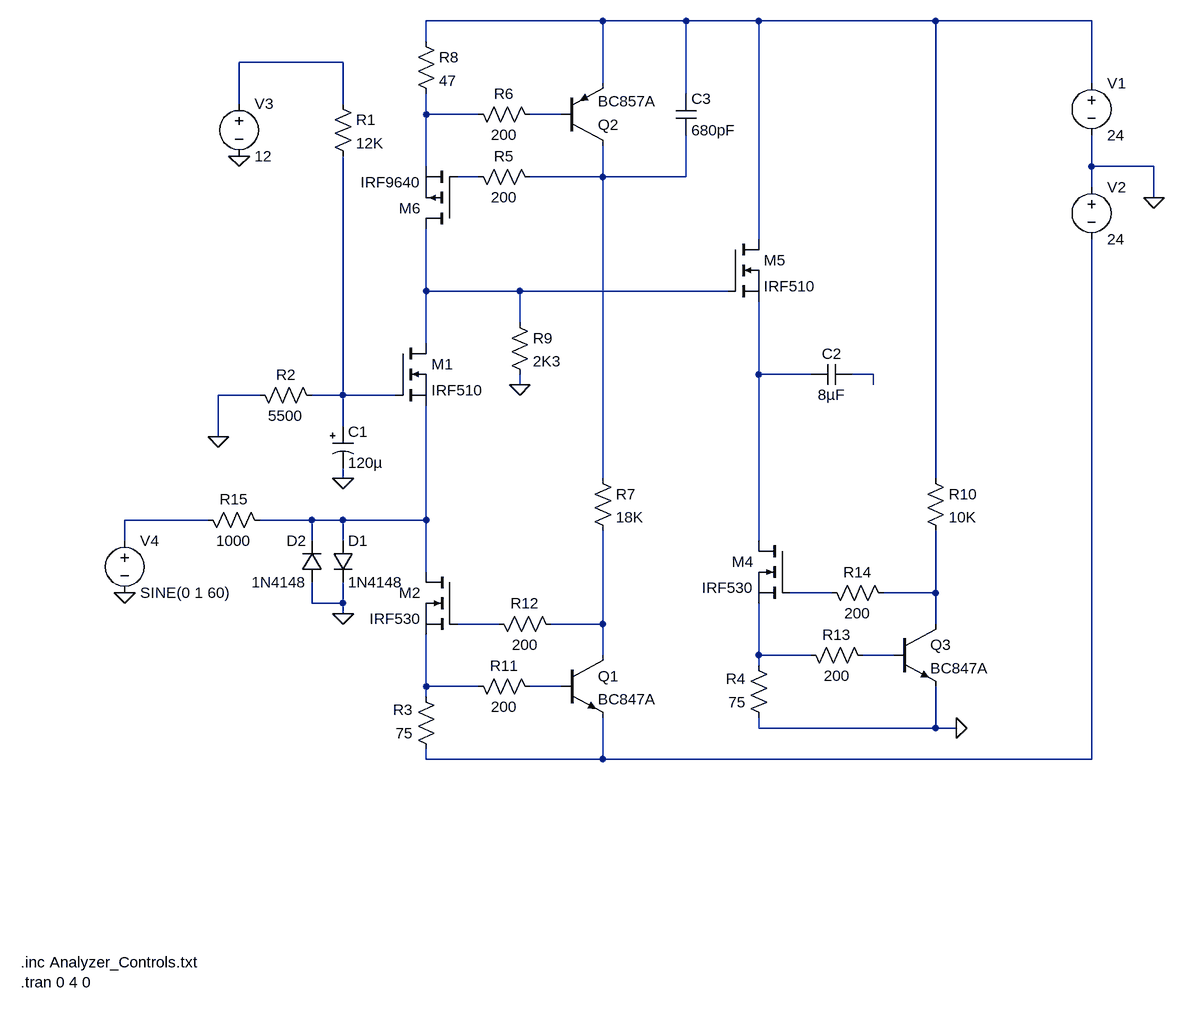
[diagram p0: schematic PASSD1.asc]
PASSD1.asc, the LTspice schematic file:
Version 4
SHEET 1 1876 1060
WIRE 288 -656 16 -656
WIRE 416 -656 288 -656
WIRE 528 -656 416 -656
WIRE 800 -656 528 -656
WIRE 1040 -656 800 -656
WIRE 16 -624 16 -656
WIRE -112 -592 -272 -592
WIRE 288 -560 288 -656
WIRE 1040 -560 1040 -656
WIRE 416 -544 416 -656
WIRE -272 -528 -272 -592
WIRE -112 -528 -112 -592
WIRE 16 -512 16 -544
WIRE 96 -512 16 -512
WIRE 224 -512 176 -512
WIRE 16 -432 16 -512
WIRE 1040 -432 1040 -480
WIRE 1136 -432 1040 -432
WIRE 96 -416 64 -416
WIRE 288 -416 288 -464
WIRE 288 -416 176 -416
WIRE 416 -416 416 -480
WIRE 416 -416 288 -416
WIRE 1040 -400 1040 -432
WIRE 1136 -384 1136 -432
WIRE 528 -320 528 -656
WIRE 16 -240 16 -336
WIRE 160 -240 16 -240
WIRE 480 -240 160 -240
WIRE 160 -192 160 -240
WIRE 16 -160 16 -240
WIRE 528 -112 528 -224
WIRE 608 -112 528 -112
WIRE 704 -112 672 -112
WIRE 160 -96 160 -112
WIRE 704 -96 704 -112
WIRE -240 -80 -304 -80
WIRE -112 -80 -112 -448
WIRE -112 -80 -160 -80
WIRE -32 -80 -112 -80
WIRE -112 -32 -112 -80
WIRE -304 -16 -304 -80
WIRE -112 48 -112 32
WIRE 288 48 288 -416
WIRE 800 48 800 -656
WIRE -320 112 -448 112
WIRE -160 112 -240 112
WIRE -112 112 -160 112
WIRE 16 112 16 -64
WIRE 16 112 -112 112
WIRE -448 144 -448 112
WIRE -160 144 -160 112
WIRE -112 144 -112 112
WIRE 528 144 528 -112
WIRE 16 192 16 112
WIRE 640 224 576 224
WIRE 800 224 800 128
WIRE 800 224 720 224
WIRE -160 240 -160 208
WIRE -112 240 -112 208
WIRE -112 240 -160 240
WIRE -112 256 -112 240
WIRE 128 272 64 272
WIRE 288 272 288 128
WIRE 288 272 208 272
WIRE 800 272 800 224
WIRE 288 320 288 272
WIRE 528 320 528 240
WIRE 608 320 528 320
WIRE 736 320 688 320
WIRE 528 336 528 320
WIRE 16 368 16 288
WIRE 96 368 16 368
WIRE 224 368 176 368
WIRE 16 384 16 368
WIRE 528 432 528 416
WIRE 800 432 800 368
WIRE 800 432 528 432
WIRE 832 432 800 432
WIRE 16 480 16 464
WIRE 288 480 288 416
WIRE 288 480 16 480
WIRE 1040 480 1040 -320
WIRE 1040 480 288 480
FLAG 160 -96 0
FLAG 1136 -384 0
FLAG -112 256 0
FLAG 832 432 0
FLAG -304 -16 0
FLAG -112 48 0
FLAG -272 -448 0
FLAG -448 224 0
SYMBOL res 32 480 R180
WINDOW 0 36 76 Left 2
WINDOW 3 36 40 Left 2
SYMATTR InstName R3
SYMATTR Value 75
SYMBOL npn 224 320 R0
SYMATTR InstName Q1
SYMATTR Value BC847A
SYMBOL pnp 224 -464 M180
SYMATTR InstName Q2
SYMATTR Value BC857A
SYMBOL res 272 32 R0
SYMATTR InstName R7
SYMATTR Value 18K
SYMBOL res 0 -640 R0
SYMATTR InstName R8
SYMATTR Value 47
SYMBOL res 144 -208 R0
SYMATTR InstName R9
SYMATTR Value 2K3
SYMBOL voltage 1040 -576 R0
WINDOW 123 0 0 Left 2
WINDOW 39 0 0 Left 2
SYMATTR InstName V1
SYMATTR Value 24
SYMBOL voltage 1040 -416 R0
WINDOW 123 0 0 Left 2
WINDOW 39 0 0 Left 2
SYMATTR InstName V2
SYMATTR Value 24
SYMBOL cap 672 -128 R90
WINDOW 0 0 32 VBottom 2
WINDOW 3 32 32 VTop 2
SYMATTR InstName C2
SYMATTR Value 8µF
SYMATTR SpiceLine V=600 Irms=0
SYMBOL cap 400 -544 R0
SYMATTR InstName C3
SYMATTR Value 680pF
SYMBOL diode -128 144 R0
SYMATTR InstName D1
SYMATTR Value 1N4148
SYMBOL diode -144 208 R180
WINDOW 0 24 64 Left 2
WINDOW 3 24 0 Left 2
SYMATTR InstName D2
SYMATTR Value 1N4148
SYMBOL res 544 432 R180
WINDOW 0 36 76 Left 2
WINDOW 3 36 40 Left 2
SYMATTR InstName R4
SYMATTR Value 75
SYMBOL npn 736 272 R0
SYMATTR InstName Q3
SYMATTR Value BC847A
SYMBOL res 784 32 R0
SYMATTR InstName R10
SYMATTR Value 10K
SYMBOL res -128 -544 R0
SYMATTR InstName R1
SYMATTR Value 12K
SYMBOL res -256 -96 M90
WINDOW 0 0 56 VBottom 2
WINDOW 3 32 56 VTop 2
SYMATTR InstName R2
SYMATTR Value 5500
SYMBOL polcap -128 -32 R0
WINDOW 3 24 56 Left 2
SYMATTR Value 120µ
SYMATTR InstName C1
SYMATTR Description Capacitor
SYMATTR Type cap
SYMATTR SpiceLine V=25 Irms=413m Rser=1 Lser=0
SYMBOL nmos -32 -160 R0
SYMATTR InstName M1
SYMATTR Value IRF510
SYMBOL nmos 64 192 M0
SYMATTR InstName M2
SYMATTR Value IRF530
SYMBOL res 80 -528 M90
WINDOW 0 0 56 VBottom 2
WINDOW 3 32 56 VTop 2
SYMATTR InstName R6
SYMATTR Value 200
SYMBOL res 80 352 M90
WINDOW 0 0 56 VBottom 2
WINDOW 3 32 56 VTop 2
SYMATTR InstName R11
SYMATTR Value 200
SYMBOL res 112 256 M90
WINDOW 0 0 56 VBottom 2
WINDOW 3 32 56 VTop 2
SYMATTR InstName R12
SYMATTR Value 200
SYMBOL res 592 304 M90
WINDOW 0 0 56 VBottom 2
WINDOW 3 32 56 VTop 2
SYMATTR InstName R13
SYMATTR Value 200
SYMBOL nmos 576 144 M0
SYMATTR InstName M4
SYMATTR Value IRF530
SYMBOL res 624 208 M90
WINDOW 0 0 56 VBottom 2
WINDOW 3 32 56 VTop 2
SYMATTR InstName R14
SYMATTR Value 200
SYMBOL nmos 480 -320 R0
SYMATTR InstName M5
SYMATTR Value IRF510
SYMBOL pmos 64 -336 R180
SYMATTR InstName M6
SYMATTR Value IRF9640
SYMBOL res 80 -432 M90
WINDOW 0 0 56 VBottom 2
WINDOW 3 32 56 VTop 2
SYMATTR InstName R5
SYMATTR Value 200
SYMBOL voltage -272 -544 R0
WINDOW 123 0 0 Left 2
WINDOW 39 0 0 Left 2
SYMATTR InstName V3
SYMATTR Value 12
SYMBOL voltage -448 128 R0
WINDOW 123 0 0 Left 2
WINDOW 39 0 0 Left 2
SYMATTR InstName V4
SYMATTR Value SINE(0 1 60)
SYMBOL res -336 96 M90
WINDOW 0 0 56 VBottom 2
WINDOW 3 32 56 VTop 2
SYMATTR InstName R15
SYMATTR Value 1000
TEXT -608 792 Left 2 !.inc Analyzer_Controls.txt\n.tran 0 4 0

The netlist it stands for:
* PASSD1.asc
R3 N021 N019 75
Q1 N016 N020 N021 0 BC847A
Q2 N006 N004 N001 0 BC857A
R7 N006 N016 18K
R8 N001 N003 47
R9 N007 0 2K3
V1 N001 0 24
V2 0 N021 24
C2 N009 N008 8µF V=600 Irms=0
C3 N001 N006 680pF
D1 N012 0 1N4148
D2 0 N012 1N4148
R4 0 N017 75
Q3 N014 N018 0 0 BC847A
R10 N001 N014 10K
R1 N002 N010 12K
R2 0 N010 5500
C1 N010 0 120µ V=25 Irms=413m Rser=1 Lser=0
M1 N007 N010 N012 N012 IRF510
M2 N012 N015 N019 N019 IRF530
R6 N003 N004 200
R11 N019 N020 200
R12 N015 N016 200
R13 N017 N018 200
M4 N008 N013 N017 N017 IRF530
R14 N013 N014 200
M5 N001 N007 N008 N008 IRF510
M6 N007 N005 N003 N003 IRF9640
R5 N005 N006 200
V3 N002 0 12
V4 N011 0 SINE(0 1 60)
R15 N011 N012 1000
.model D D
.lib standard.dio
.model NPN NPN
.model PNP PNP
.lib standard.bjt
.model NMOS NMOS
.model PMOS PMOS
.lib standard.mos
.inc Analyzer_Controls.txt
.tran 0 4 0
.backanno
.end